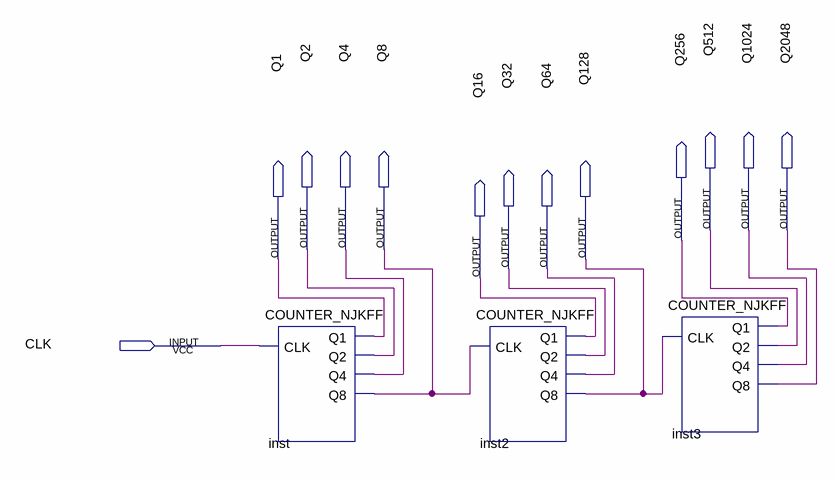
[diagram p0: schematic sheet]
// Quartus schematic THOUSAND_COUNTER.bdf as structural Verilog: 3 symbols, 13 pins
module THOUSAND_COUNTER (
  input  CLK,
  output Q512,
  output Q1024,
  output Q2048,
  output Q256,
  output Q2,
  output Q4,
  output Q8,
  output Q1,
  output Q128,
  output Q32,
  output Q64,
  output Q16
);

  COUNTER_NJKFF inst (.CLK(CLK), .Q2(Q2), .Q8(Q8), .Q1(Q1), .Q4(Q4));
  COUNTER_NJKFF inst2 (.CLK(Q8), .Q2(Q32), .Q8(Q128), .Q1(Q16), .Q4(Q64));
  COUNTER_NJKFF inst3 (.CLK(Q128), .Q2(Q512), .Q8(Q2048), .Q1(Q256), .Q4(Q1024));
endmodule
